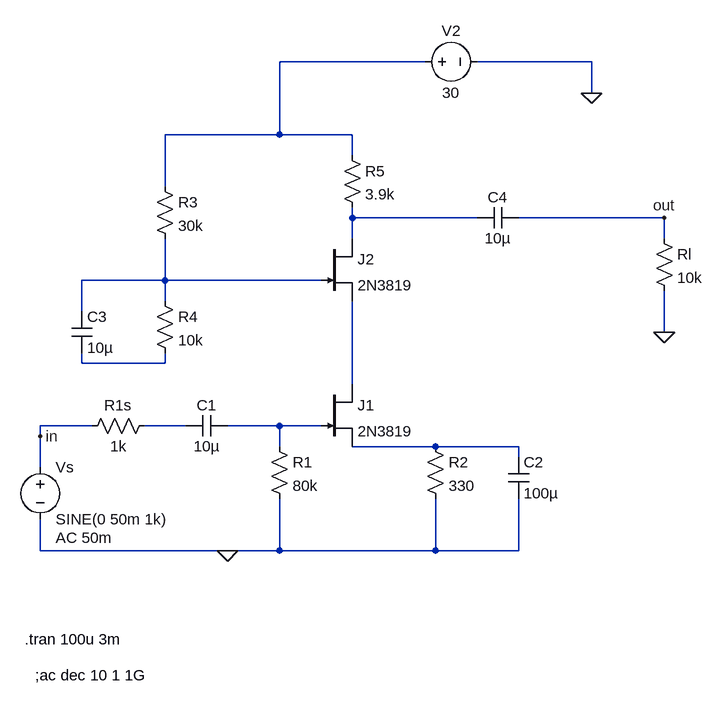
[diagram p0: schematic Cascode amplifier.asc]
Cascode amplifier.asc, the LTspice schematic file:
Version 4
SHEET 1 880 680
WIRE 48 -336 -176 -336
WIRE 304 -336 128 -336
WIRE 304 -288 304 -336
WIRE -176 -224 -176 -336
WIRE -176 -224 -352 -224
WIRE -64 -224 -176 -224
WIRE -64 -192 -64 -224
WIRE -352 -144 -352 -224
WIRE -64 -96 -64 -112
WIRE 128 -96 -64 -96
WIRE 416 -96 192 -96
WIRE -64 -64 -64 -96
WIRE 416 -64 416 -96
WIRE -352 0 -352 -64
WIRE -352 0 -480 0
WIRE -112 0 -352 0
WIRE -352 32 -352 0
WIRE -480 48 -480 0
WIRE 416 80 416 16
WIRE -480 128 -480 112
WIRE -352 128 -352 112
WIRE -352 128 -480 128
WIRE -64 160 -64 32
WIRE -464 224 -544 224
WIRE -320 224 -384 224
WIRE -176 224 -256 224
WIRE -112 224 -176 224
WIRE -544 240 -544 224
WIRE -176 256 -176 224
WIRE 64 256 -64 256
WIRE 192 256 64 256
WIRE 192 272 192 256
WIRE -544 288 -544 240
WIRE -544 416 -544 368
WIRE -256 416 -544 416
WIRE -176 416 -176 336
WIRE -176 416 -256 416
WIRE 64 416 64 336
WIRE 64 416 -176 416
WIRE 192 416 192 336
WIRE 192 416 64 416
FLAG 304 -288 0
FLAG 416 80 0
FLAG -256 416 0
FLAG -544 240 in
FLAG 416 -96 out
SYMBOL voltage -544 272 R0
WINDOW 123 24 124 Left 2
WINDOW 39 0 0 Left 0
SYMATTR InstName Vs
SYMATTR Value SINE(0 50m 1k)
SYMATTR Value2 AC 50m
SYMBOL res -368 208 R90
WINDOW 0 0 56 VBottom 2
WINDOW 3 32 56 VTop 2
SYMATTR InstName R1s
SYMATTR Value 1k
SYMBOL cap -256 208 R90
WINDOW 0 0 32 VBottom 2
WINDOW 3 32 32 VTop 2
SYMATTR InstName C1
SYMATTR Value 10µ
SYMBOL res -192 240 R0
SYMATTR InstName R1
SYMATTR Value 80k
SYMBOL njf -112 160 R0
SYMATTR InstName J1
SYMATTR Value 2N3819
SYMBOL njf -112 -64 R0
SYMATTR InstName J2
SYMATTR Value 2N3819
SYMBOL res 48 240 R0
SYMATTR InstName R2
SYMATTR Value 330
SYMBOL cap 176 272 R0
SYMATTR InstName C2
SYMATTR Value 100µ
SYMBOL res -368 -160 R0
SYMATTR InstName R3
SYMATTR Value 30k
SYMBOL res -368 16 R0
SYMATTR InstName R4
SYMATTR Value 10k
SYMBOL cap -496 48 R0
SYMATTR InstName C3
SYMATTR Value 10µ
SYMBOL res -80 -208 R0
SYMATTR InstName R5
SYMATTR Value 3.9k
SYMBOL cap 192 -112 R90
WINDOW 0 0 32 VBottom 2
WINDOW 3 32 32 VTop 2
SYMATTR InstName C4
SYMATTR Value 10µ
SYMBOL res 400 -80 R0
SYMATTR InstName Rl
SYMATTR Value 10k
SYMBOL voltage 32 -336 R270
WINDOW 0 32 56 VTop 2
WINDOW 3 -32 56 VBottom 2
WINDOW 123 0 0 Left 0
WINDOW 39 0 0 Left 0
SYMATTR InstName V2
SYMATTR Value 30
TEXT -568 552 Left 2 !.tran 100u 3m
TEXT -552 608 Left 2 !;ac dec 10 1 1G

The netlist it stands for:
* Cascode amplifier.asc
Vs in 0 SINE(0 50m 1k) AC 50m
R1s N006 in 1k
C1 N007 N006 10µ
R1 N007 0 80k
J1 N005 N007 N008 2N3819
J2 N002 N003 N005 2N3819
R2 N008 0 330
C2 N008 0 100µ
R3 N001 N003 30k
R4 N003 N004 10k
C3 N003 N004 10µ
R5 N001 N002 3.9k
C4 out N002 10µ
Rl out 0 10k
V2 N001 0 30
.model NJF NJF
.model PJF PJF
.lib standard.jft
.tran 100u 3m
;ac dec 10 1 1G
.backanno
.end